# EAGLE design Autonomous Rover (EAGLE 8.2.2)
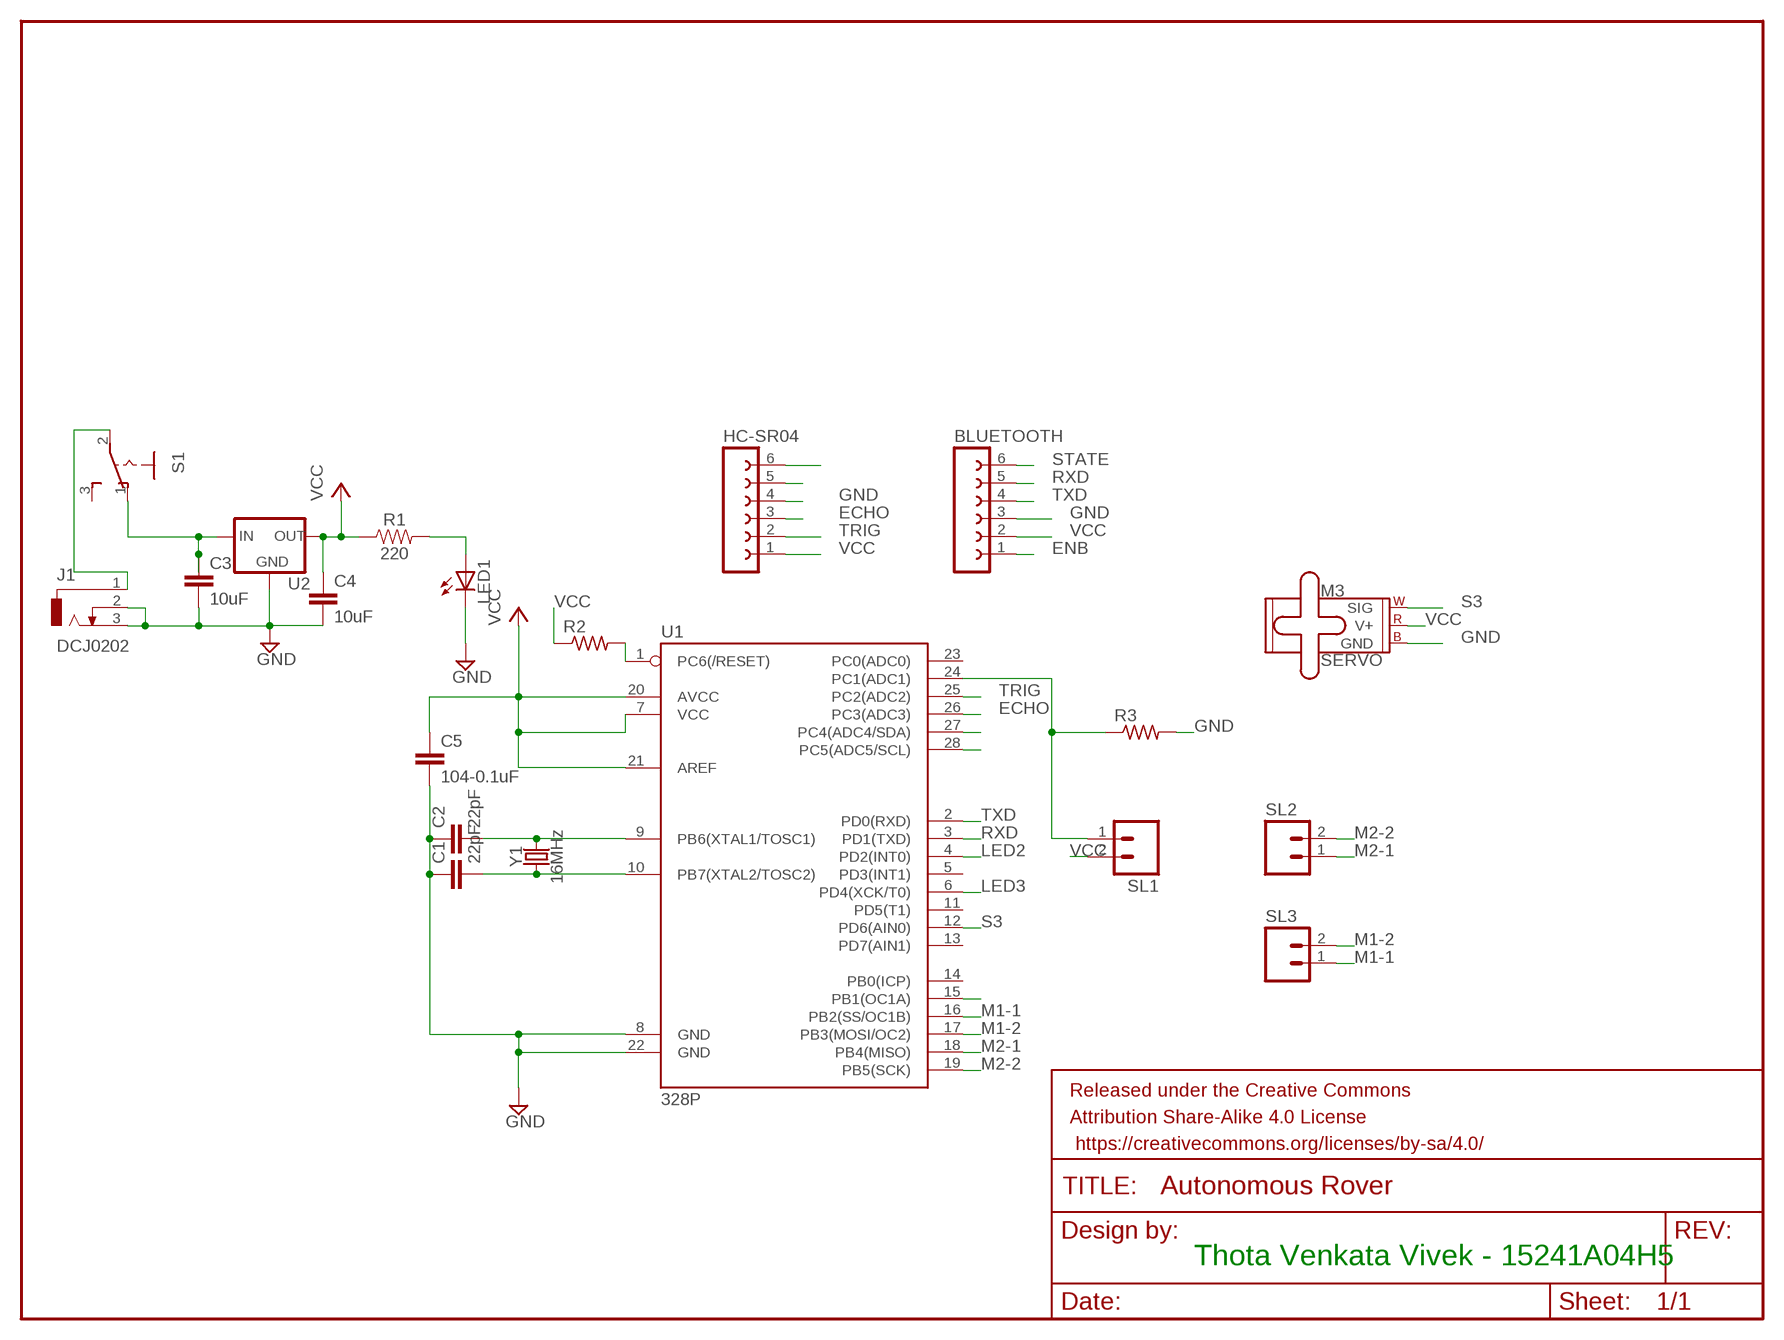
[diagram p0: schematic, sheet 1]

## Parts
BLUETOOTH  FE06-1  [FE06]
C1  22pF  C2,5-3  [C2.5-3]
C2  22pF  C2,5-3  [C2.5-3]
C3  10uF  C2,5-3  [C2.5-3]
C4  10uF  C2,5-3  [C2.5-3]
C5  104-0.1uF  C2,5-3  [C2.5-3]
FRAME1  FRAME-LETTER  [CREATIVE_COMMONS]
HC-SR04  FE06-1  [FE06]
J1  DCJ0202  [DCJ0202]
LED1  LED3MM  [LED3MM]
M3  SERVO  [1X03]
R1  220  10KOHM-HORIZ-1/4W-5%  [AXIAL-0.3]
R2  R-US_0204/7  [0204/7]
R3  R-US_0204/7  [0204/7]
S1  255SB  [255SB]
SL1  M02  [02P]
SL2  M02  [02P]
SL3  M02  [02P]
U1  328P  ATMEGA328P_PDIP  [DIP28]
U2  V_REG_78XX-TO-220  [TO-220-ALT]
Y1  16MHz  CRYSTAL-16MHZPTH-HC49US  [HC49US]

## Nets
ECHO: HC-SR04.3 U1.26(PC3(ADC3))
ENB: BLUETOOTH.1
GND: BLUETOOTH.3 C1.1 C2.1 C3.2 C4.2 C5.2 HC-SR04.4 HC-SR04.6 J1.2 J1.3 LED1.K(C) M3.3(GND) R3.2 U1.8(GND) U1.22(GND) U2.GND
LED2: U1.4(PD2(INT0))
LED3: HC-SR04.5 U1.6(PD4(XCK/T0))
M1-1: SL3.1 U1.16(PB2(SS/OC1B))
M1-2: SL3.2 U1.17(PB3(MOSI/OC2))
M2-1: SL2.1 U1.18(PB4(MISO))
M2-2: SL2.2 U1.19(PB5(SCK))
N$1: J1.1 S1.2(P)
N$2: C2.2 U1.9(PB6(XTAL1/TOSC1)) Y1.2
N$3: C3.1 S1.1(O) U2.IN
N$4: C1.2 U1.10(PB7(XTAL2/TOSC2)) Y1.1
N$5: LED1.A R1.P$2
N$7: R2.2 U1.1(PC6(/RESET))
N$8: R3.1 SL1.1 U1.24(PC1(ADC1))
RXD: BLUETOOTH.5 U1.3(PD1(TXD))
S3: M3.1(SIG) U1.12(PD6(AIN0))
S4: U1.15(PB1(OC1A))
STATE: BLUETOOTH.6
TRIG: HC-SR04.2 U1.25(PC2(ADC2))
TXD: BLUETOOTH.4 U1.2(PD0(RXD))
VCC: BLUETOOTH.2 C4.1 C5.1 HC-SR04.1 M3.2(V+) R1.P$1 R2.1 SL1.2 U1.7(VCC) U1.20(AVCC) U1.21(AREF) U2.OUT
Y: U1.27(PC4(ADC4/SDA))
Z: U1.28(PC5(ADC5/SCL))
Unconnected: S1.3(S) U1.5(PD3(INT1)) U1.11(PD5(T1)) U1.13(PD7(AIN1)) U1.14(PB0(ICP)) U1.23(PC0(ADC0))

## Notes on the sheet
- Thota Venkata Vivek - 15241A04H5

## Library data of the parts
BLUETOOTH HC-SR04 = con-lsta:FE06-1: FEMALE HEADER
C1-C5 = capacitor-wima:C: CAPACITOR naming: grid - package width
FRAME1 = SparkFun-Aesthetics:FRAME-LETTER: Schematic Frame - Letter Standard 8.5x11 US Letter frame
J1 = con-jack:DCJ0202: DC POWER JACK Source: DCJ0202.pdf; OC_FARNELL: unknown; OC_NEWARK: unknown
LED1 = adafruit:LED: LED OSRAM: - CHIPLED LG R971, LG N971, LY N971, LG Q971, LY Q971, LO R971, LY R971 LH N974, LH R974 LS Q976, LO Q976, LY Q976 LO Q996 - Hyper CHIPLED LW Q18S LB Q993, LB Q99A, LB R99A - SideLED LS A670, LO A670, LY A670, LG A670, LP A670 LB A673, LV A673, LT A673, LW A673 LH A674 LY A675 LS A676, LA A676, LO A676, LY A676, LW A676 LS A679, LY A679, LG A679 - Hyper Micro SIDELED® LS Y876, LA Y876, LO Y876, LY Y876 LT Y87S - SmartLED LW L88C, LW L88S LB L89C, LB L89S, LG L890 LS L89K, LO L89K, LY L89K LS L896, LA L896, LO L896, LY L896 - TOPLED LS T670, LO T670, LY T670, LG T670, LP T670 LSG T670, LSP T670, LSY T670, LOP T670, LYG T670 LG T671, LOG T671, LSG T671 LB T673, LV T673, LT T673, LW T673 LH T674 LS T676, LA T676, LO T676, LY T676, LB T676, LH T676, LSB T676, LW T676 LB T67C, LV T67C, LT T67C, LS T67K, LO T67K, LY T67K, LW E67C LS E67B, LA E67B, LO E67B, LY E67B, LB E67C, LV E67C, LT E67C LW T67C LS T679, LY T679, LG T679 LS T770, LO T770, LY T770, LG T770, LP T770 LB T773, LV T773, LT T773, LW T773 LH T774 LS E675, LA E675, LY E675, LS T675 LS T776, LA T776, LO T776, LY T776, LB T776 LHGB T686 LT T68C, LB T68C - Hyper Mini TOPLED® LB M676 - Mini TOPLED Santana® LG M470 LS M47K, LO M47K, LY M47K Source: http://www.osram.convergy.de/
M3 = SparkFun-Electromechanical:SERVO: Servo Motor 3-pin connector for a standard servo motor (voltage supply, ground, and control signal.) SparkFun Products Servo - Generic (Sub-Micro Size) <https://www.sparkfun.com/products/9065> (ROB-09065) Servo - Generic High Torque Continuous Rotation (Standard Size) <https://www.sparkfun.com/products/9347> (ROB-09347) Servo - Generic High Torque (Standard Size) <https://www.sparkfun.com/products/11965> (ROB-11965)
R1 = SparkFun-Resistors:10KOHM: 10kΩ resistor A resistor is a passive two-terminal electrical component that implements electrical resistance as a circuit element. Resistors act to reduce current flow, and, at the same time, act to lower voltage levels within circuits. - Wikipedia; PROD_ID: RES-09435; VALUE: 10k
R2 R3 = adafruit:R-US_: RESISTOR, American symbol
S1 = switch:255SB: SLIDING SWITCH Distributor Buerklin, 11G810
SL1-SL3 = con-amp-quick:M02: AMP QUICK CONNECTOR; OC_FARNELL: unknown; OC_NEWARK: unknown
U1 = SparkFun-IC-Microcontroller:ATMEGA328P_PDIP: Atmel 328P Through hole ATMEGA328P uC used in the Arduino 32kb flash, 1k EEPROM, 2k SRAM Datasheet <http://www.sparkfun.com/datasheets/Components/SMD/ATMega328.pdf> SparkFun Products Storefront component: AVR 28 Pin 20MHz 32K 6A/D - ATMega328P <https://www.sparkfun.com/products/9061> (COM-09061) SparkFun Simon Says - Through-Hole Soldering Kit <https://www.sparkfun.com/products/10547> (KIT-10547) SparkFun Learn to Solder - Simon Says <https://www.sparkfun.com/products/13708> (KIT-13708) SparkFun BigTime Watch Kit <https://www.sparkfun.com/products/11734> (KIT-11734) SparkFun ClockIt <https://www.sparkfun.com/products/10930> (KIT-10930) SparkFun Serial Enabled LCD Kit <https://www.sparkfun.com/products/10097> (LCD-10097) SparkFun Simon Tilts - Through Hole Soldering Kit <https://www.sparkfun.com/products/12634> (KIT-12634) SparkFun Frequency Counter Kit <https://www.sparkfun.com/products/10140> (KIT-10140) FabFM Radio Kit <https://www.sparkfun.com/products/11043> (KIT-11043) SparkFun Binary Blaster Kit <https://www.sparkfun.com/products/12037> (KIT-12037) SparkFun Metro-Gnome <https://www.sparkfun.com/products/9236> (KIT-09236) ATmega328 with Arduino Optiboot (Uno) <https://www.sparkfun.com/products/10524> (DEV-10524); PROD_ID: IC-09136
U2 = SparkFun-IC-Power:V_REG_78XX: Voltage Regulator Standard 78xx regulator. IGO (Input Ground Output). Spark Fun Electronics SKU : COM-00107; PROD_ID: VREG-08450; SF_ID: COM-00107
Y1 = SparkFun-Clocks:CRYSTAL-16MHZ: 16MHz Crystal Digikey Example <http://www.digikey.com/product-search/en?keywords=535-9122-1-ND> Frequency: 16MHz Frequency Stability: ±50ppm Frequency Tolerance: ±20ppm Load Capacitance: 18pF SparkFun Products: Pro Micro -5V/16MHz <https://www.sparkfun.com/products/12640> SparkFun Serial Enabled LCD Kit <https://www.sparkfun.com/products/10097>; PROD_ID: XTAL-08181; SF_ID: COM-00536

## Board
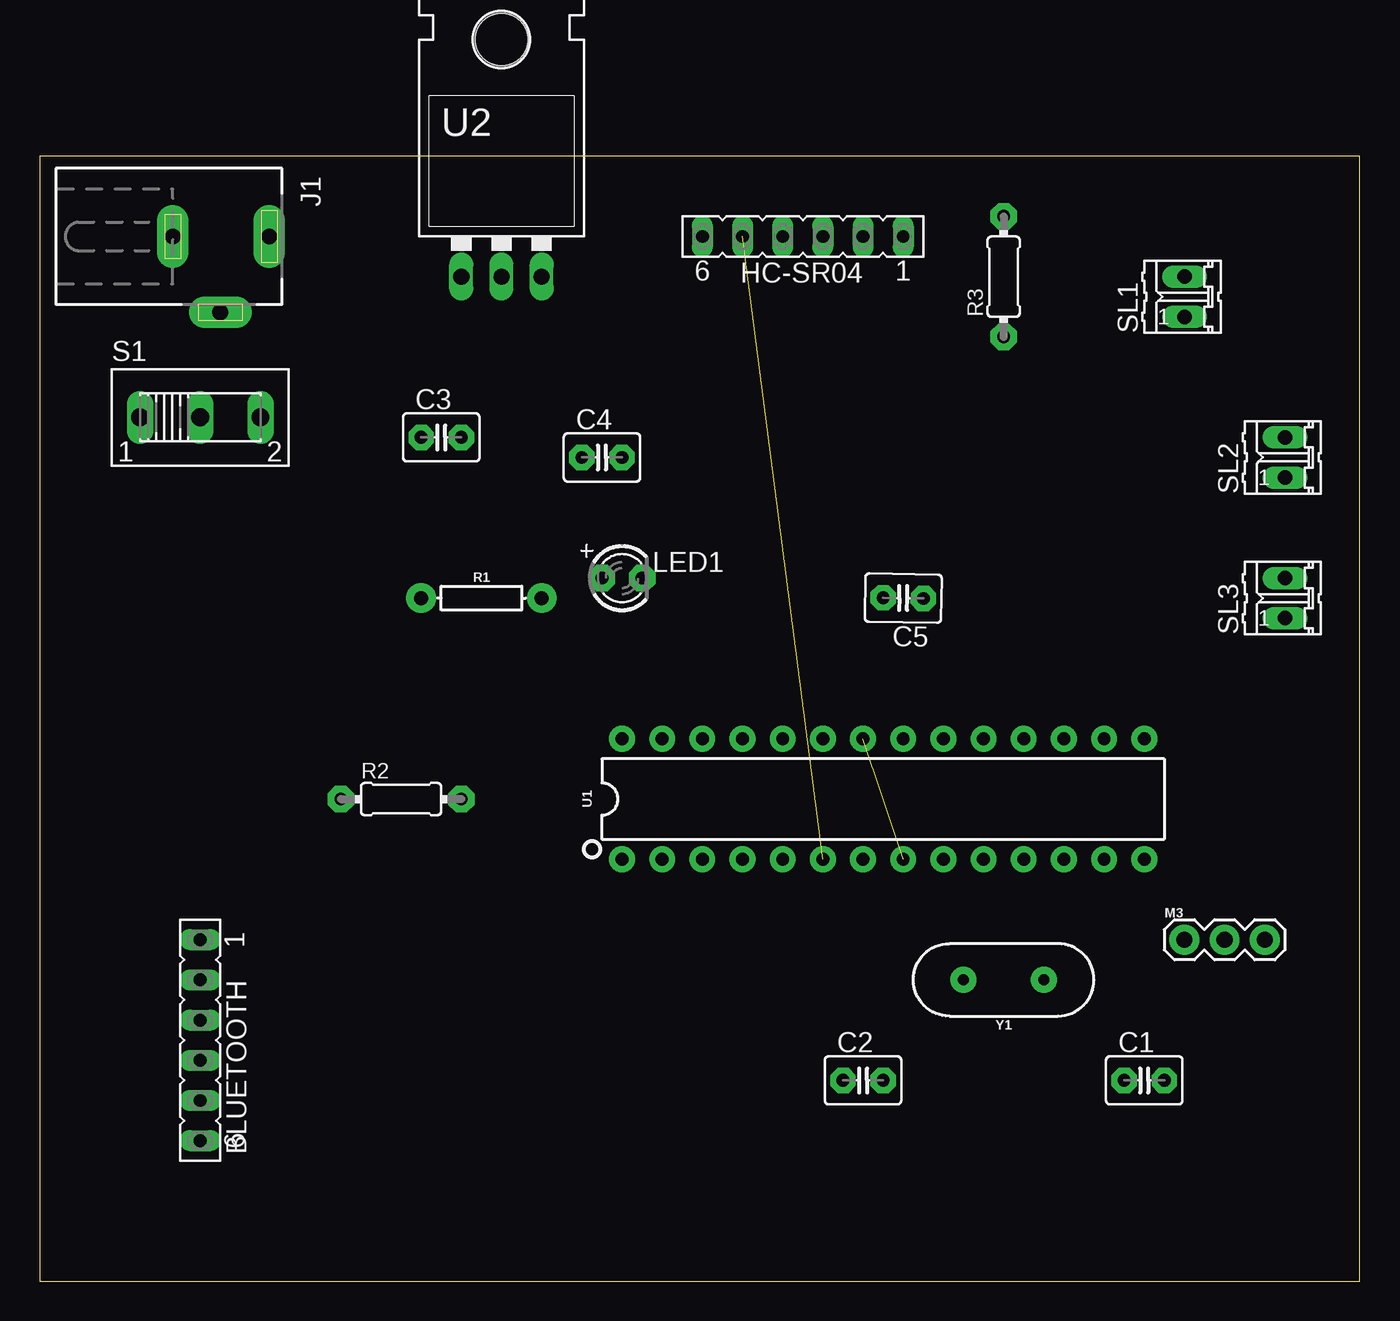
[diagram p1: board, top side]
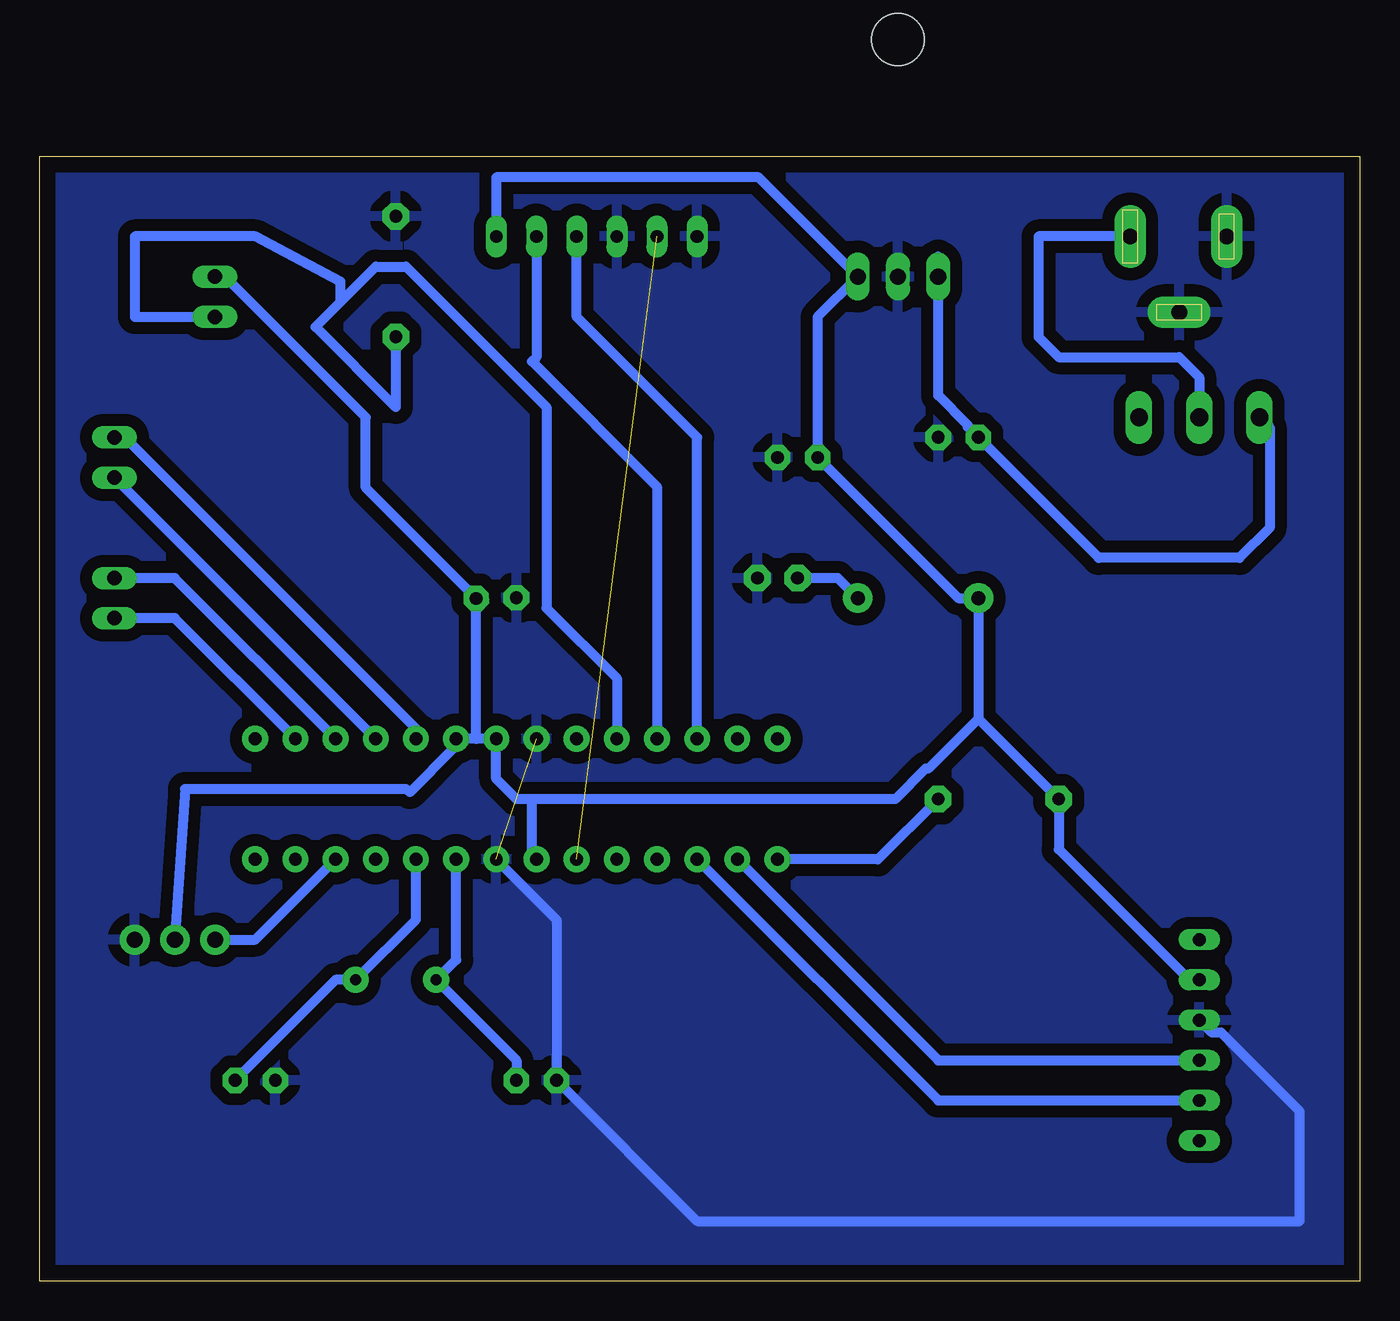
[diagram p2: board, bottom side, seen from below]

Size 83.49 x 71.11 mm. Coordinates in mm from the lower left corner, seen from the top.
Outline: 0,0 83.49,0 83.49,71.11 0,71.11 0,0
Copper layers (1*16): Top 0.035mm / dielectric 1.5mm / Bottom 0.035mm
Design rules "default *": minimum track width 25mil, minimum drill 2mm, track to track 30mil, track to pad 30mil, pad to pad 30mil, via to via 30mil, smd to smd 30mil, copper to edge 40mil, drill to drill 6mil, minimum pad ring 10mil, minimum via ring 8mil, stop-mask expansion 4mil, vias tented up to drill 0mil, thermal gap 30mil

### Footprints (pad centres in the part's own frame; a part is rotated, then mirrored left to right if it is on the bottom)
FE06 = drill 0.813 long: 1 -6.35,0; 2 -3.81,0; 3 -1.27,0; 4 1.27,0; 5 3.81,0; 6 6.35,0
C2.5-3 = drill 0.813 pad 1.6 octagon: 1 -1.27,0; 2 1.27,0
DCJ0202 = drill 1 pad 2 long: 1 0,3.1; 2 4.8,0; 3 0,-3
LED3MM = drill 0.813 pad 1.676 octagon: A -1.27,0; K 1.27,0
1X03 = drill 1.016 pad 1.88: 1 0,0; 2 2.54,0; 3 5.08,0
AXIAL-0.3 = drill 0.9 pad 1.88: P$1 -3.81,0; P$2 3.81,0
0204/7 = drill 0.813 pad 1.676 octagon: 1 -3.81,0; 2 3.81,0
255SB = drill 1.118 long: 1 -3.81,0; 2 0,0; 3 3.81,0
02P = drill 0.914 long: 1 -1.27,0; 2 1.27,0
DIP28 = drill 0.813 pad 1.626: 1 -16.51,-3.81; 2 -13.97,-3.81; 3 -11.43,-3.81; 4 -8.89,-3.81; 5 -6.35,-3.81; 6 -3.81,-3.81; 7 -1.27,-3.81; 8 1.27,-3.81; 9 3.81,-3.81; 10 6.35,-3.81; 11 8.89,-3.81; 12 11.43,-3.81; 13 13.97,-3.81; 14 16.51,-3.81; 15 16.51,3.81; 16 13.97,3.81; 17 11.43,3.81; 18 8.89,3.81; 19 6.35,3.81; 20 3.81,3.81; 21 1.27,3.81; 22 -1.27,3.81; 23 -3.81,3.81; 24 -6.35,3.81; 25 -8.89,3.81; 26 -11.43,3.81; 27 -13.97,3.81; 28 -16.51,3.81
TO-220-ALT = drill 1.016 long: GND 0,-3.81; IN -2.54,-3.81; OUT 2.54,-3.81 | hole 3.302: 0,11.176
HC49US = drill 0.7 pad 1.651: 1 -2.54,0; 2 2.54,0

### Placement (x,y rotation side)
BLUETOOTH  10.16,15.24 270 top
C1  69.85,12.7 0 top
C2  52.07,12.7 0 top
C3  25.4,53.34 0 top
C4  35.56,52.07 0 top
C5  54.61,43.18 179.1 top
HC-SR04  48.26,66.04 180 top
J1  11.43,66.04 270 top
LED1  36.83,44.45 0 top
M3  72.39,21.59 0 top
R1  27.94,43.18 0 top
R2  22.86,30.48 0 top
R3  60.96,63.5 90 top
S1  10.16,54.61 0 top
SL1  72.39,62.23 90 top
SL2  78.74,52.07 90 top
SL3  78.74,43.18 90 top
U1  53.34,30.48 0 top
U2  29.21,67.31 0 top
Y1  60.96,19.05 180 top

### Tracks (layer width: path | path; a pad name or v marks a point on that pad's centre or on a via)
ECHO
  Bottom 0.635: HC-SR04.3 49.53,60.96 41.91,53.34 U1.26
GND  (1 unrouted)
  Bottom 0.635: U1.8 50.8,22.86 C2.1 41.91,3.81 3.81,3.81 3.81,10.74 8.78,15.71 9.36,15.71 BLUETOOTH.3
  pour Bottom: -2.54,72.39 -2.54,-3.81 87.63,-3.81 87.63,72.39
LED3  (1 unrouted)
M1-1
  Bottom 0.635: SL3.1 74.93,41.91 U1.16
M1-2
  Bottom 0.635: SL3.2 74.93,44.45 U1.17
M2-1
  Bottom 0.635: U1.18 SL2.1
M2-2
  Bottom 0.635: SL2.2 78.11,53.34 59.69,34.92 U1.19
N$1
  Bottom 0.635: J1.1 20.32,66.04 20.32,59.69 19.05,58.42 11.43,58.42 10.16,57.15 S1.2
N$2
  Bottom 0.635: C2.2 53.34,13.97 Y1.2 57.15,20.32 U1.9
N$3
  Bottom 0.635: 26.67,64.77 U2.IN 26.67,56 24.79,54.12 24.79,54 C3.1 16.51,45.72 7.62,45.72 5.71,47.62 5.71,53.98 S1.1
N$4
  Bottom 0.635: C1.2 64.77,19.05 Y1.1 59.69,22.86 U1.10
N$5
  Bottom 0.635: LED1.A 33.02,44.45 R1.P$2
N$7
  Bottom 0.635: U1.1 30.48,26.67 R2.2
N$8
  Bottom 0.635: R3.1 60.96,55.25 66.04,60.33 64.45,61.91 | U1.24 46.99,38.1 51.44,42.55 51.44,55.25 60.33,64.14 62.23,64.14 64.45,61.91 | 64.45,61.91 64.45,63.18 69.85,66.04 77.47,66.04 77.47,60.96 SL1.1
RXD
  Bottom 0.635: BLUETOOTH.5 26.67,11.43 U1.3
S3
  Bottom 0.635: U1.12 69.85,21.59 M3.1
TRIG
  Bottom 0.635: HC-SR04.2 52.07,58.42 52.35,58.14 44.45,50.24 U1.25
TXD
  Bottom 0.635: BLUETOOTH.4 26.67,13.97 U1.2
VCC
  Bottom 0.635: SL1.2 71.75,63.5 62.87,54.61 62.87,50.16 55.88,43.18 C5.1 55.88,42.55 55.88,34.29 | 55.88,34.29 U1.21 54.61,31.75 53.34,30.48 52.39,30.48 | 55.88,34.29 U1.20 57.28,33.72 60.07,30.92 60.33,31.12 74.3,31.12 M3.2 | BLUETOOTH.2 10.79,19.05 19.05,27.3 R2.1 24.13,35.56 | HC-SR04.1 54.61,69.78 38.03,69.78 U2.OUT 34.29,60.96 C4.1 25.4,43.18 R1.P$1 24.13,35.56 | 24.13,35.56 27.29,32.4 27.46,32.4 29.38,30.48 52.39,30.48 | 52.39,30.48 52.39,26.73 U1.7